# EAGLE schematic LED_panel_rev3.15 (EAGLE 9.0.1)

## Sheet 1 of 8: Supply
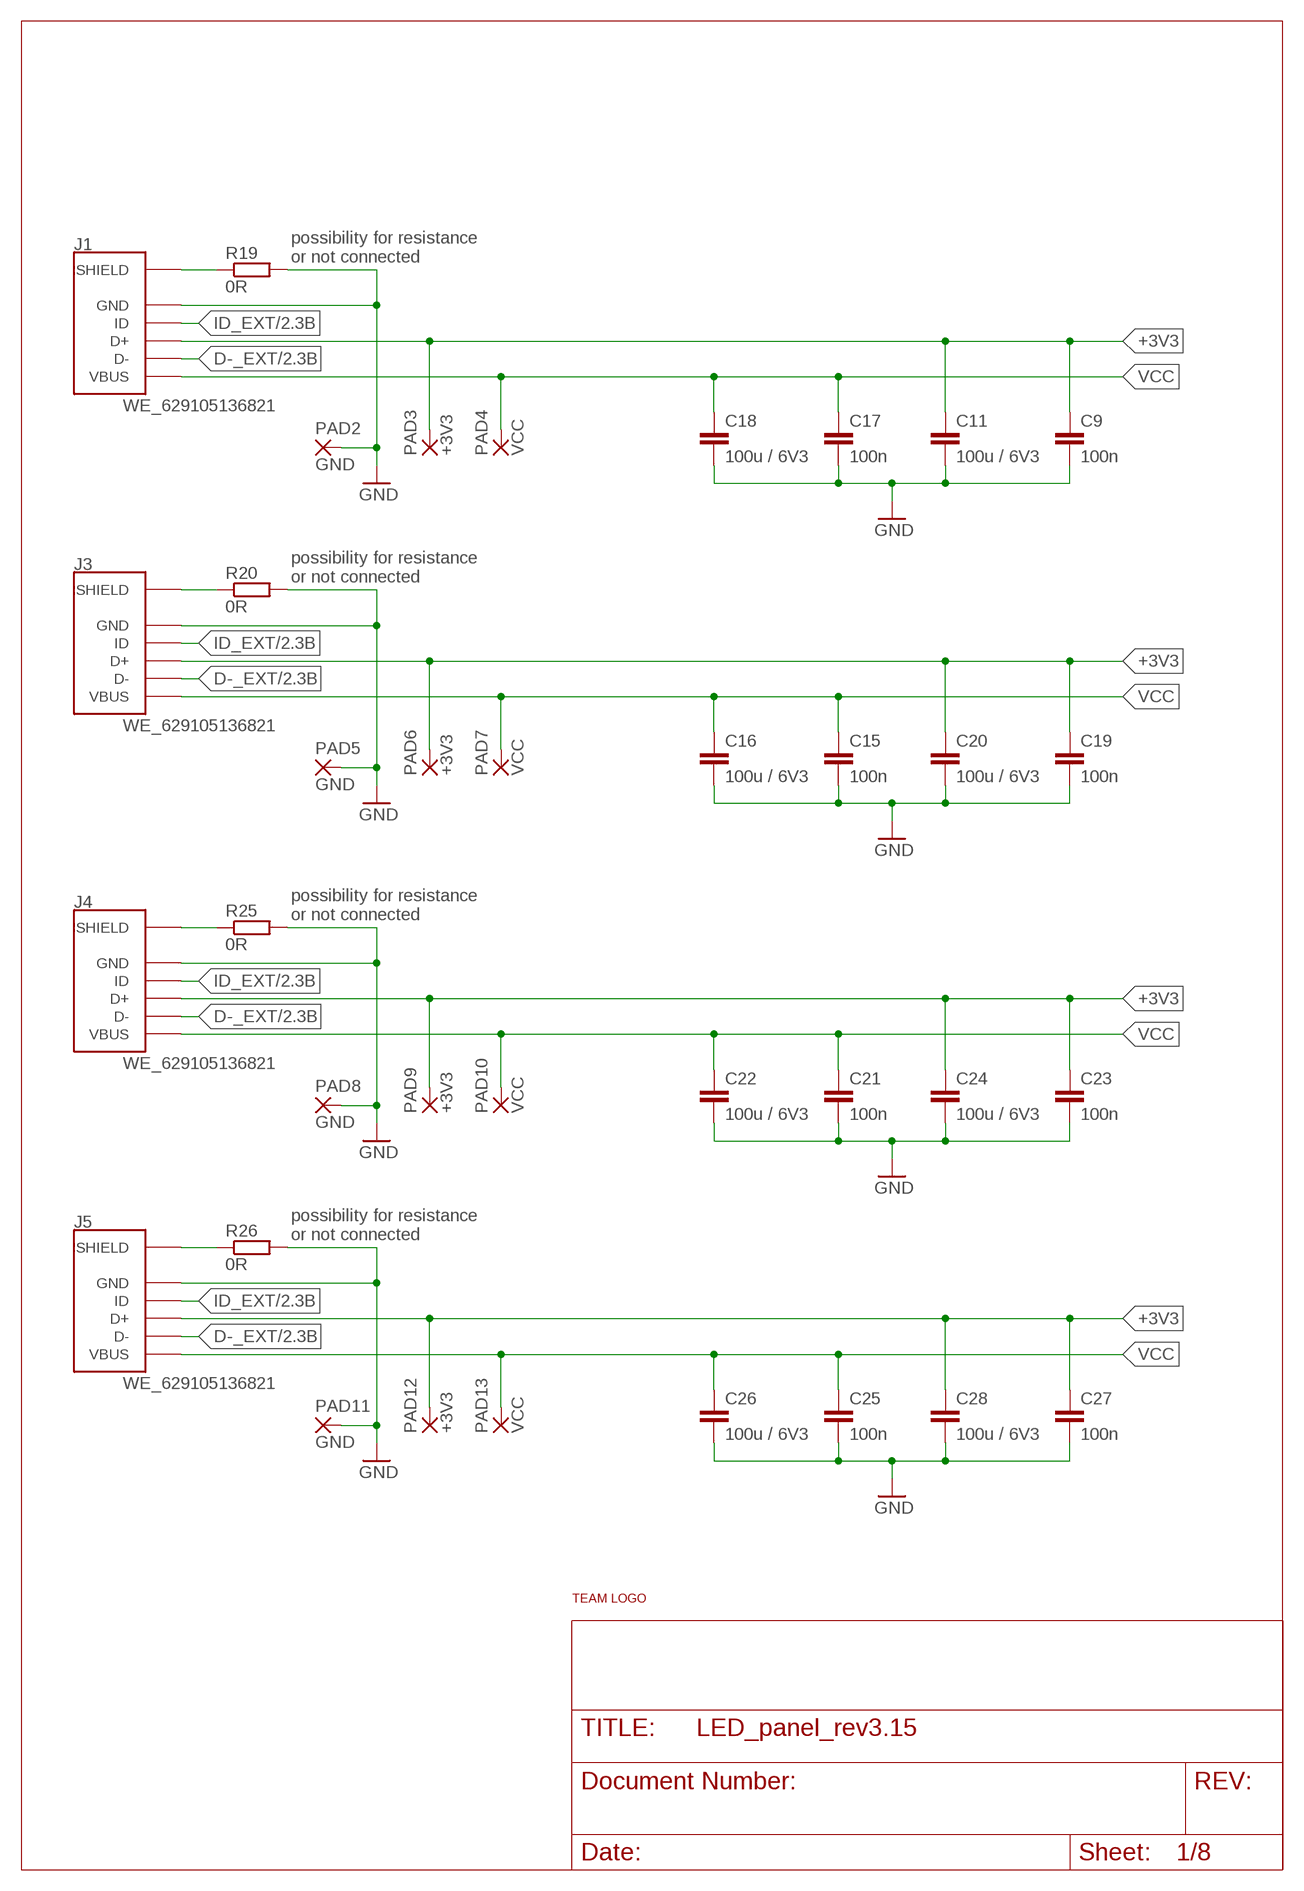
[diagram p0: schematic, sheet 1]

### Parts
C9  100n  C-EUC1206K  [C1206K]
C11  100u / 6V3  C-EUC1206K  [C1206K]
C15  100n  C-EUC1206K  [C1206K]
C16  100u / 6V3  C-EUC1206K  [C1206K]
C17  100n  C-EUC1206K  [C1206K]
C18  100u / 6V3  C-EUC1206K  [C1206K]
C19  100n  C-EUC1206K  [C1206K]
C20  100u / 6V3  C-EUC1206K  [C1206K]
C21  100n  C-EUC1206K  [C1206K]
C22  100u / 6V3  C-EUC1206K  [C1206K]
C23  100n  C-EUC1206K  [C1206K]
C24  100u / 6V3  C-EUC1206K  [C1206K]
C25  100n  C-EUC1206K  [C1206K]
C26  100u / 6V3  C-EUC1206K  [C1206K]
C27  100n  C-EUC1206K  [C1206K]
C28  100u / 6V3  C-EUC1206K  [C1206K]
J1  WE_629105136821  [629105136821]
J3  WE_629105136821  [629105136821]
J4  WE_629105136821  [629105136821]
J5  WE_629105136821  [629105136821]
PAD2  GND  2,54/1,0  [2,54/1,0]
PAD3  +3V3  2,54/1,0  [2,54/1,0]
PAD4  VCC  2,54/1,0  [2,54/1,0]
PAD5  GND  2,54/1,0  [2,54/1,0]
PAD6  +3V3  2,54/1,0  [2,54/1,0]
PAD7  VCC  2,54/1,0  [2,54/1,0]
PAD8  GND  2,54/1,0  [2,54/1,0]
PAD9  +3V3  2,54/1,0  [2,54/1,0]
PAD10  VCC  2,54/1,0  [2,54/1,0]
PAD11  GND  2,54/1,0  [2,54/1,0]
PAD12  +3V3  2,54/1,0  [2,54/1,0]
PAD13  VCC  2,54/1,0  [2,54/1,0]
R19  0R  R-EU_R1206  [R1206]
R20  0R  R-EU_R1206  [R1206]
R25  0R  R-EU_R1206  [R1206]
R26  0R  R-EU_R1206  [R1206]
U$99  LOGO_RESTRICT  [LOGO_RESTRICT]

### Nets
+3V3 [supply]: C9.1 C11.1 C19.1 C20.1 C23.1 C24.1 C27.1 C28.1 J1.3(D+) J3.3(D+) J4.3(D+) J5.3(D+) PAD3.1(P) PAD6.1(P) PAD9.1(P) PAD12.1(P) ; also sheet 2,3,4,5,6
D-_EXT: J1.2(D-) J3.2(D-) J4.2(D-) J5.2(D-) ; also sheet 2
GND [supply]: C9.2 C11.2 C15.2 C16.2 C17.2 C18.2 C19.2 C20.2 C21.2 C22.2 C23.2 C24.2 C25.2 C26.2 C27.2 C28.2 J1.5(GND) J3.5(GND) J4.5(GND) J5.5(GND) PAD2.1(P) PAD5.1(P) PAD8.1(P) PAD11.1(P) R19.2 R20.2 R25.2 R26.2 ; also sheet 2,3,4,5,6,7
ID_EXT: J1.4(ID) J3.4(ID) J4.4(ID) J5.4(ID) ; also sheet 2,3
SHIELD1: J1.6(SHIELD) J1.7(SHIELD) J1.8(SHIELD) J1.9(SHIELD) R19.1
SHIELD3: J3.6(SHIELD) J3.7(SHIELD) J3.8(SHIELD) J3.9(SHIELD) R20.1
SHIELD4: J4.6(SHIELD) J4.7(SHIELD) J4.8(SHIELD) J4.9(SHIELD) R25.1
SHIELD5: J5.6(SHIELD) J5.7(SHIELD) J5.8(SHIELD) J5.9(SHIELD) R26.1
VCC [supply]: C15.1 C16.1 C17.1 C18.1 C21.1 C22.1 C25.1 C26.1 J1.1(VBUS) J3.1(VBUS) J4.1(VBUS) J5.1(VBUS) PAD4.1(P) PAD7.1(P) PAD10.1(P) PAD13.1(P) ; also sheet 3,5,6

### Notes on the sheet
- possibility for resistance
  or not connected
- possibility for resistance
  or not connected
- possibility for resistance
  or not connected
- possibility for resistance
  or not connected

## Sheet 2 of 8: teensy 3.2
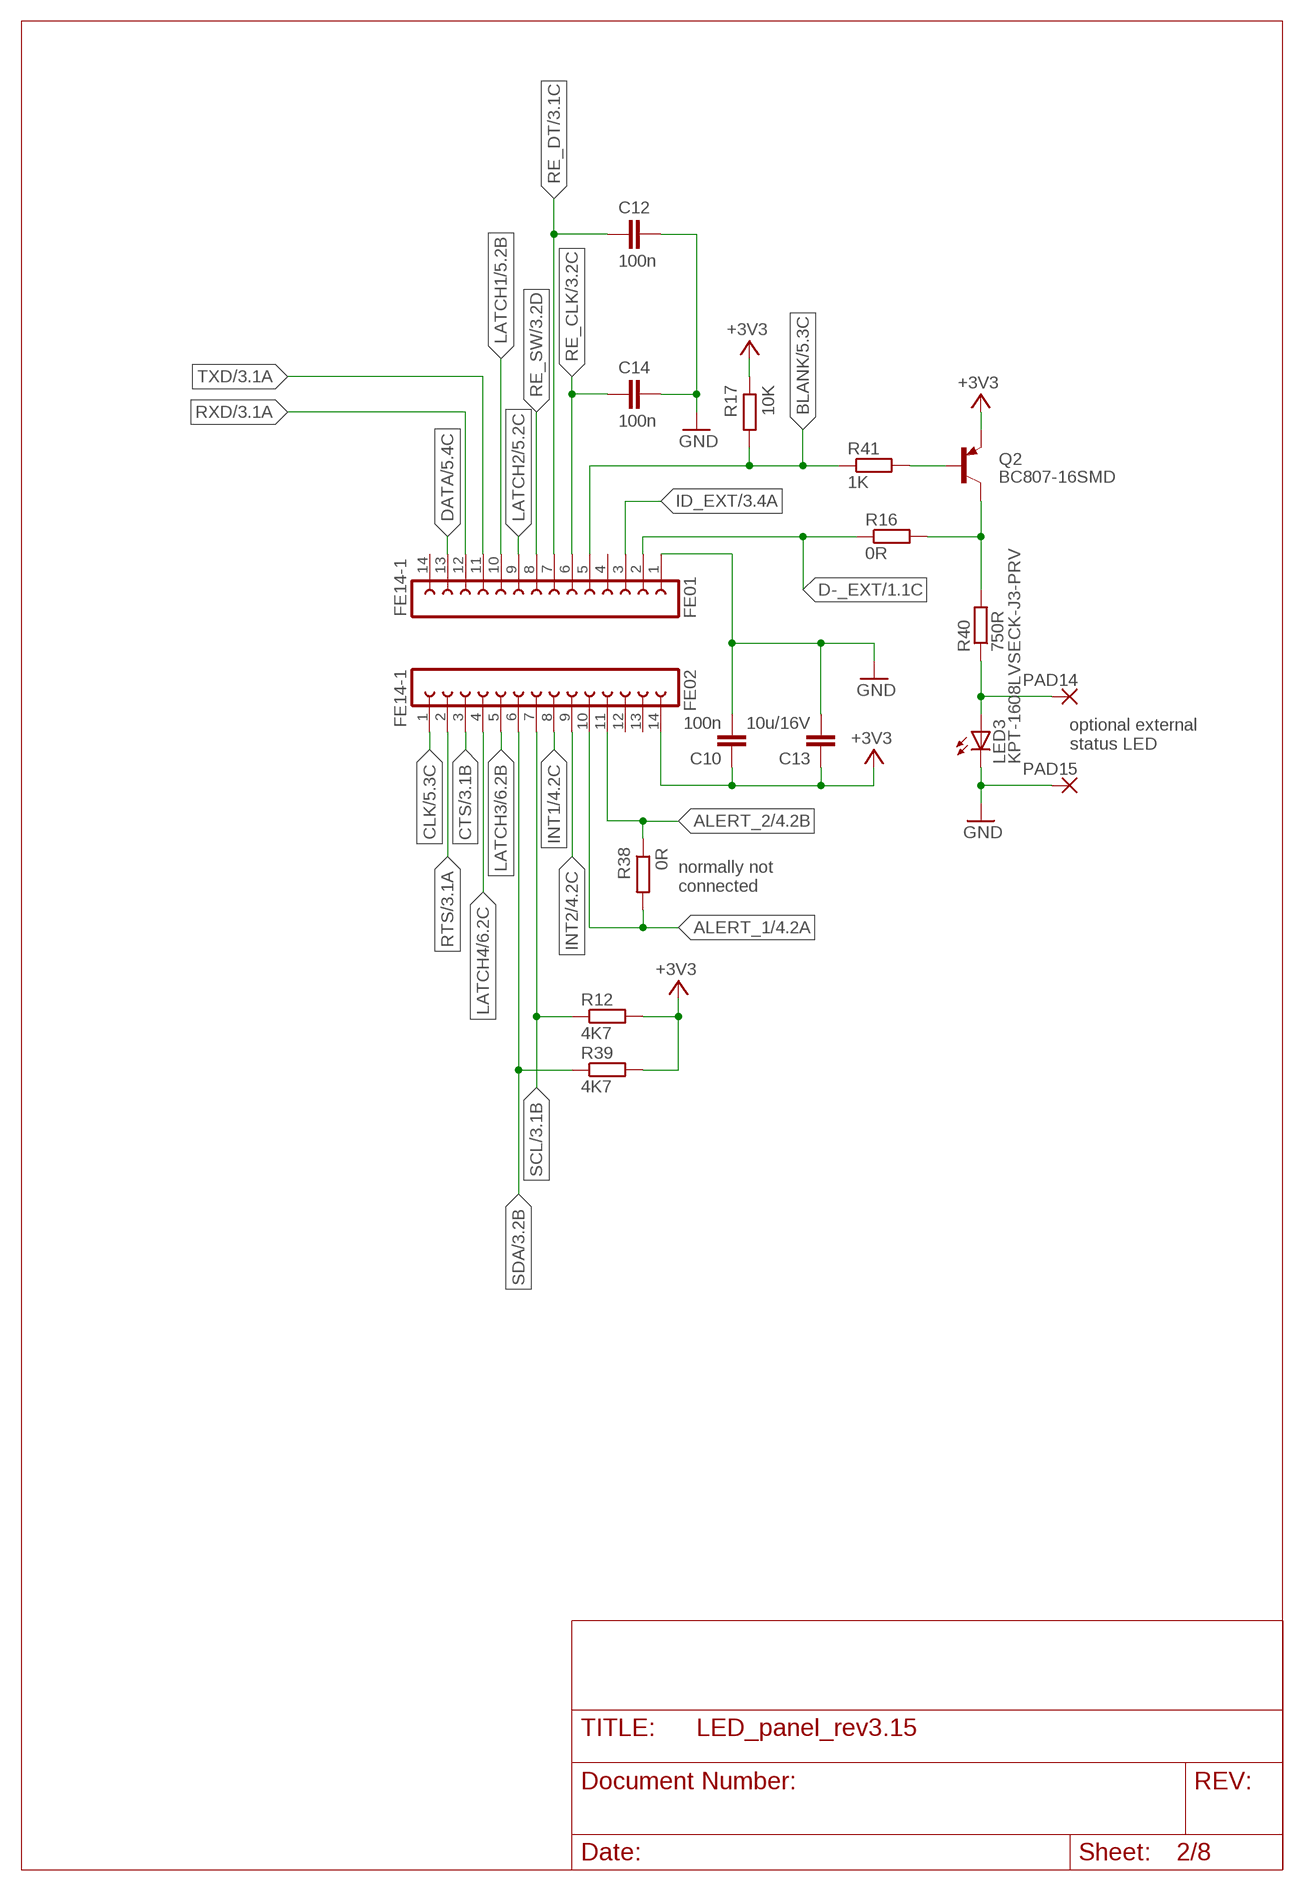
[diagram p1: schematic, sheet 2]

### Parts
C10  100n  C-EUC1206K  [C1206K]
C12  100n  C-EUC1206K  [C1206K]
C13  10u/16V  C-EUC1206K  [C1206K]
C14  100n  C-EUC1206K  [C1206K]
FE01  FE14-1  [FE14]
FE02  FE14-1  [FE14]
LED3  KPT-1608LVSECK-J3-PRV  [MH_KINGBRIGHT_1.6X0.8]
PAD14  2,54/1,0  [2,54/1,0]
PAD15  2,54/1,0  [2,54/1,0]
Q2  BC807-16SMD  [SOT23-BEC]
R12  4K7  R-EU_R1206  [R1206]
R16  0R  R-EU_R1206  [R1206]
R17  10K  R-EU_R1206  [R1206]
R38  0R  R-EU_R1206  [R1206]
R39  4K7  R-EU_R1206  [R1206]
R40  750R  R-EU_R1206  [R1206]
R41  1K  R-EU_R1206  [R1206]

### Nets
+3V3 [supply]: C10.1 C13.1 FE02.14 Q2.E R12.2 R17.1 R39.2 ; also sheet 1,3,4,5,6
ALERT_1: FE02.10 R38.2 ; also sheet 4
ALERT_2: FE02.11 R38.1 ; also sheet 4
BLANK: FE01.5 R17.2 R41.1 ; also sheet 5,6
CLK: FE02.1 ; also sheet 5,6
CTS: FE02.3 ; also sheet 3
D-_EXT: FE01.2 R16.1 ; also sheet 1
DATA: FE01.13 ; also sheet 5,6
GND [supply]: C10.2 C12.1 C13.2 C14.1 FE01.1 LED3.C PAD15.1(P) ; also sheet 1,3,4,5,6,7
ID_EXT: FE01.3 ; also sheet 1,3
INT1: FE02.8 ; also sheet 4
INT2: FE02.9 ; also sheet 4
LATCH1: FE01.10 ; also sheet 5
LATCH2: FE01.9 ; also sheet 5
LATCH3: FE02.5 ; also sheet 6
LATCH4: FE02.4 ; also sheet 6
N$84: Q2.B R41.2
N$109: Q2.C R16.2 R40.2
N$113: LED3.A PAD14.1(P) R40.1
RE_CLK: C14.2 FE01.6 ; also sheet 3
RE_DT: C12.2 FE01.7 ; also sheet 3
RE_SW: FE01.8 ; also sheet 3
RTS: FE02.2 ; also sheet 3
RXD: FE01.12 ; also sheet 3
SCL: FE02.7 R12.1 ; also sheet 3,4
SDA: FE02.6 R39.1 ; also sheet 3,4
TXD: FE01.11 ; also sheet 3
Unconnected: FE01.4 FE01.14 FE02.12 FE02.13

### Notes on the sheet
- optional external
  status LED
- normally not
  connected

## Sheet 3 of 8: connectivity
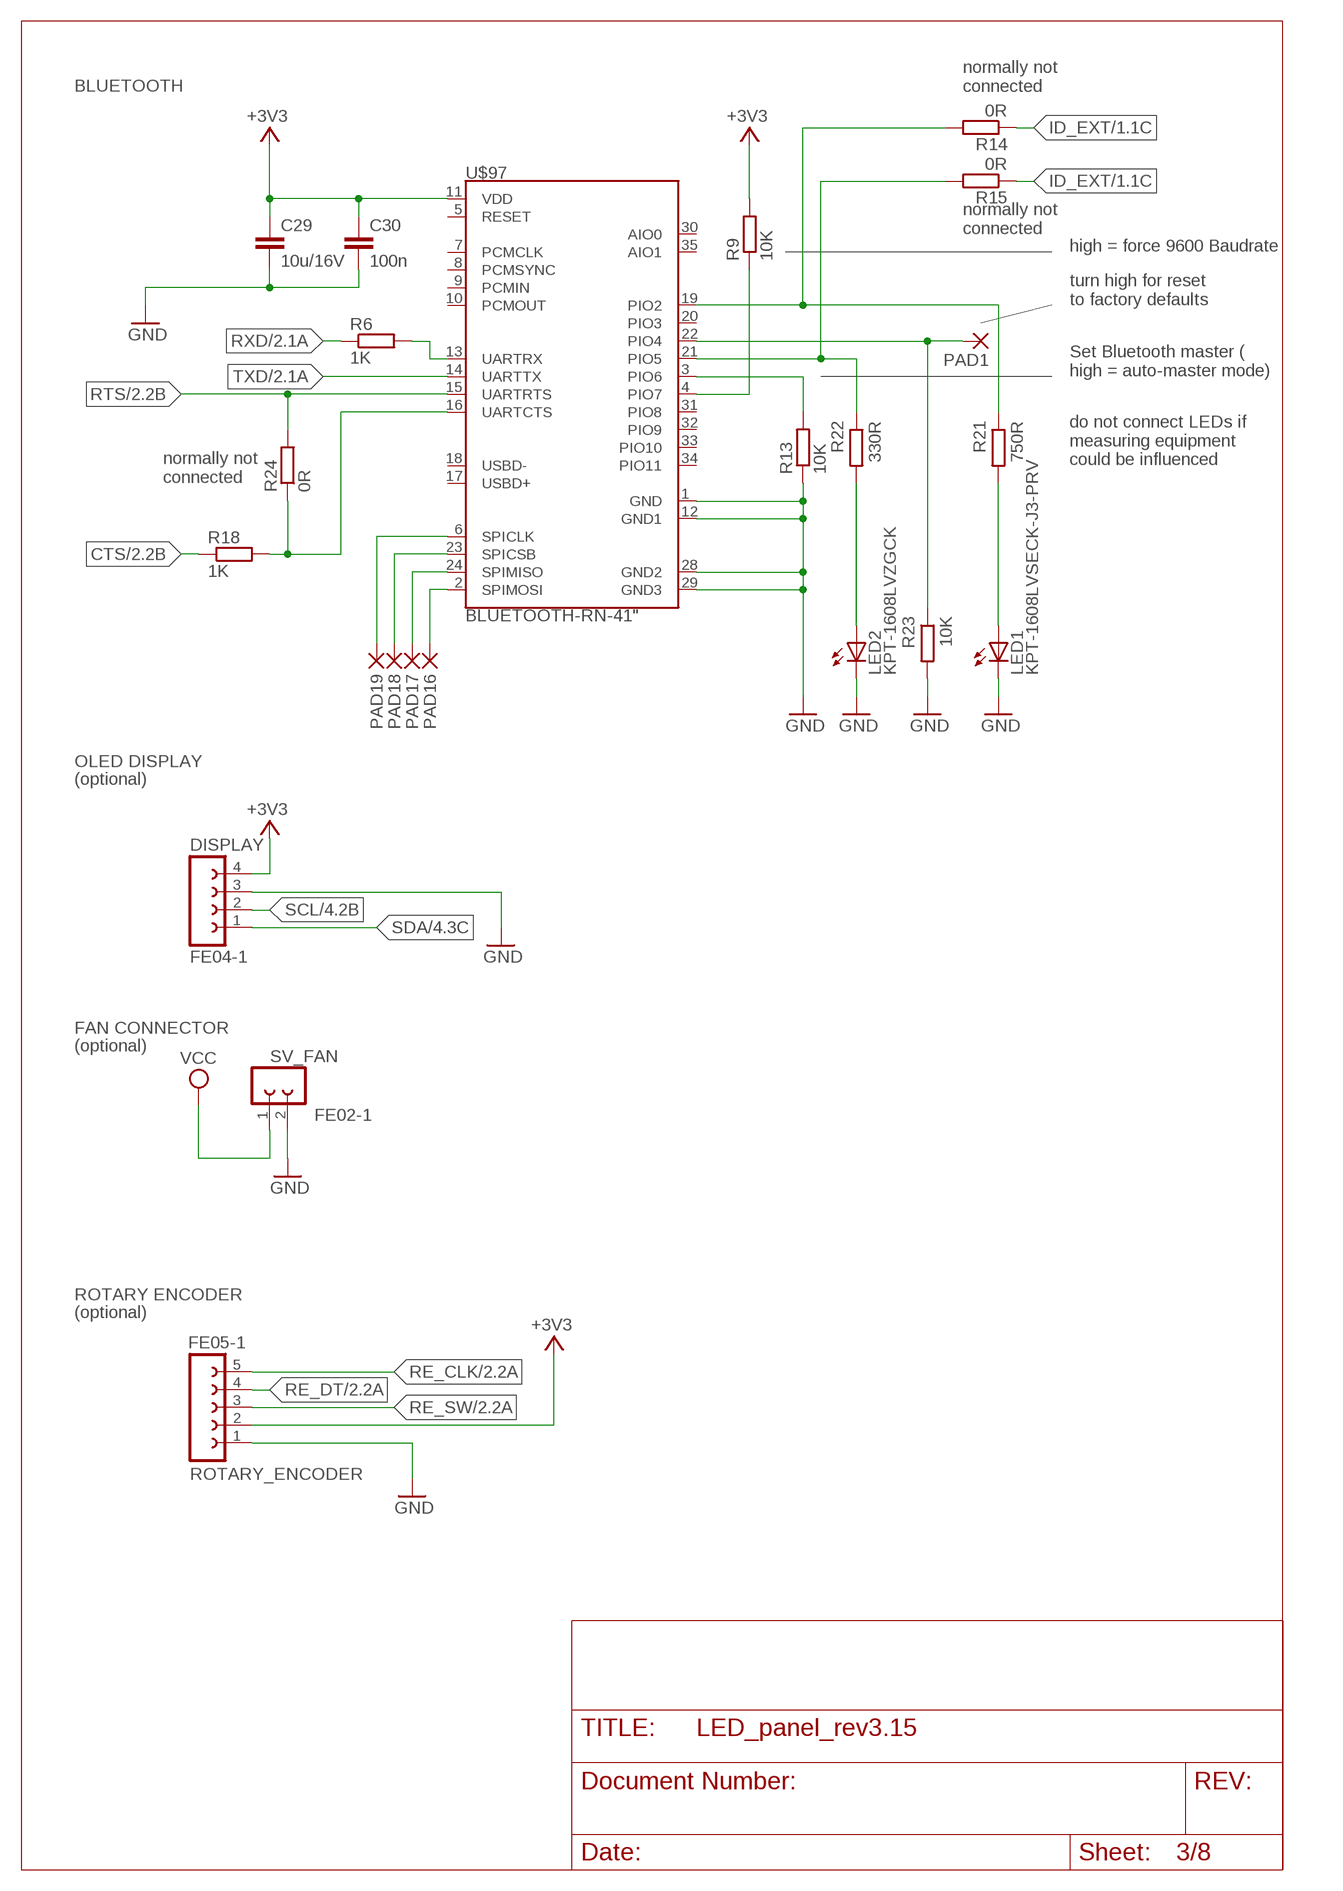
[diagram p2: schematic, sheet 3]

### Parts
C29  10u/16V  C-EUC1206K  [C1206K]
C30  100n  C-EUC1206K  [C1206K]
DISPLAY  FE04-1  [FE04]
LED1  KPT-1608LVSECK-J3-PRV  [MH_KINGBRIGHT_1.6X0.8]
LED2  KPT-1608LVZGCK  [MH_KINGBRIGHT_1.6X0.8]
PAD1  2,54/1,0  [2,54/1,0]
PAD16  2,54/1,0  [2,54/1,0]
PAD17  2,54/1,0  [2,54/1,0]
PAD18  2,54/1,0  [2,54/1,0]
PAD19  2,54/1,0  [2,54/1,0]
R6  1K  R-EU_R1206  [R1206]
R9  10K  R-EU_R1206  [R1206]
R13  10K  R-EU_R1206  [R1206]
R14  0R  R-EU_R1206  [R1206]
R15  0R  R-EU_R1206  [R1206]
R18  1K  R-EU_R1206  [R1206]
R21  750R  R-EU_R1206  [R1206]
R22  330R  R-EU_R1206  [R1206]
R23  10K  R-EU_R1206  [R1206]
R24  0R  R-EU_R1206  [R1206]
ROTARY_ENCODER  FE05-1  [FE05]
SV_FAN  FE02-1  [FE02]
U$97  BLUETOOTH-RN-41"  [RN41]

### Nets
+3V3 [supply]: C29.1 C30.1 DISPLAY.4 R9.2 ROTARY_ENCODER.2 U$97.11(VDD) ; also sheet 1,2,4,5,6
CTS: R18.1 ; also sheet 2
GND [supply]: C29.2 C30.2 DISPLAY.3 LED1.C LED2.C R13.1 R23.2 ROTARY_ENCODER.1 SV_FAN.2 U$97.1(GND) U$97.12(GND1) U$97.28(GND2) U$97.29(GND3) ; also sheet 1,2,4,5,6,7
ID_EXT: R14.1 R15.1 ; also sheet 1,2
N$1: R9.1 U$97.4(PIO7)
N$22: R13.2 U$97.3(PIO6)
N$23: R18.2 R24.1 U$97.16(UARTCTS)
N$56: PAD16.1(P) U$97.2(SPIMOSI)
N$83: PAD17.1(P) U$97.24(SPIMISO)
N$110: R6.2 U$97.13(UARTRX)
N$112: PAD18.1(P) U$97.23(SPICSB)
N$115: R15.2 R22.1 U$97.21(PIO5)
N$116: LED2.A R22.2
N$117: PAD19.1(P) U$97.6(SPICLK)
N$118: LED1.A R21.2
N$120: R14.2 R21.1 U$97.19(PIO2)
PIO4: PAD1.1(P) R23.1 U$97.22(PIO4)
RE_CLK: ROTARY_ENCODER.5 ; also sheet 2
RE_DT: ROTARY_ENCODER.4 ; also sheet 2
RE_SW: ROTARY_ENCODER.3 ; also sheet 2
RTS: R24.2 U$97.15(UARTRTS) ; also sheet 2
RXD: R6.1 ; also sheet 2
SCL: DISPLAY.2 ; also sheet 2,4
SDA: DISPLAY.1 ; also sheet 2,4
TXD: U$97.14(UARTTX) ; also sheet 2
VCC [supply]: SV_FAN.1 ; also sheet 1,5,6
Unconnected: U$97.5(RESET) U$97.7(PCMCLK) U$97.8(PCMSYNC) U$97.9(PCMIN) U$97.10(PCMOUT) U$97.17(USBD+) U$97.18(USBD-) U$97.20(PIO3) U$97.30(AIO0) U$97.31(PIO8) U$97.32(PIO9) U$97.33(PIO10) U$97.34(PIO11) U$97.35(AIO1)

### Notes on the sheet
- BLUETOOTH
- normally not
  connected
- normally not
  connected
- high = force 9600 Baudrate
- turn high for reset
  to factory defaults
- Set Bluetooth master (
  high = auto-master mode)
- do not connect LEDs if 
  measuring equipment 
  could be influenced
- normally not
  connected
- OLED DISPLAY
- (optional)
- FAN CONNECTOR
- (optional)
- ROTARY ENCODER
- (optional)

## Sheet 4 of 8: sensors
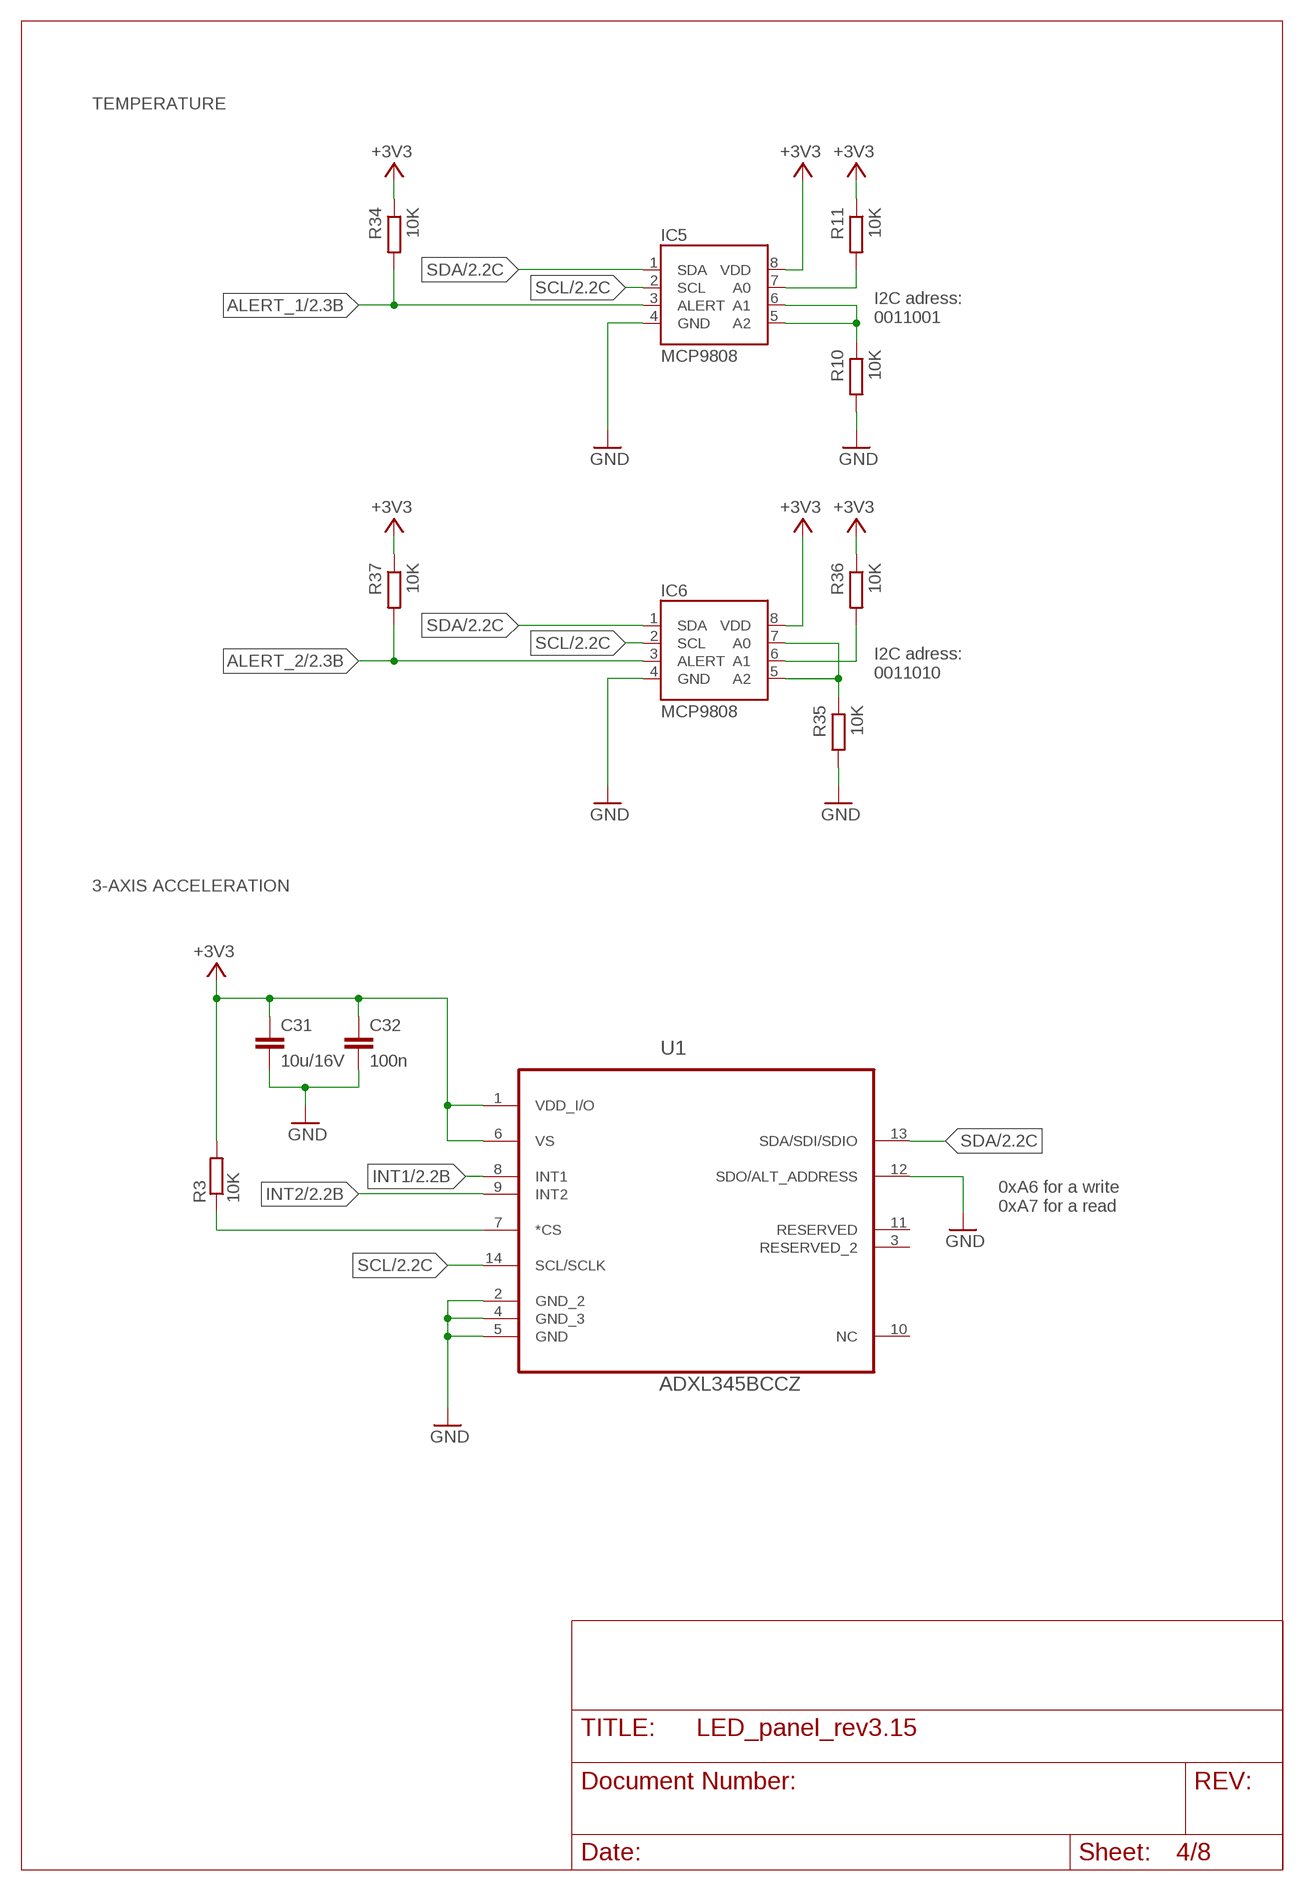
[diagram p3: schematic, sheet 4]

### Parts
C31  10u/16V  C-EUC1206K  [C1206K]
C32  100n  C-EUC1206K  [C1206K]
IC5  MCP9808  [MSOP8]
IC6  MCP9808  [MSOP8]
R3  10K  R-EU_R1206  [R1206]
R10  10K  R-EU_R1206  [R1206]
R11  10K  R-EU_R1206  [R1206]
R34  10K  R-EU_R1206  [R1206]
R35  10K  R-EU_R1206  [R1206]
R36  10K  R-EU_R1206  [R1206]
R37  10K  R-EU_R1206  [R1206]
U1  ADXL345BCCZ  [LGA14R80P3X6_300X500X100]

### Nets
+3V3 [supply]: C31.1 C32.1 IC5.8(VDD) IC6.8(VDD) R3.2 R11.1 R34.1 R36.1 R37.1 U1.1(VDD_I/O) U1.6(VS) ; also sheet 1,2,3,5,6
ALERT_1: IC5.3(ALERT) R34.2 ; also sheet 2
ALERT_2: IC6.3(ALERT) R37.2 ; also sheet 2
GND [supply]: C31.2 C32.2 IC5.4(GND) IC6.4(GND) R10.2 R35.2 U1.2(GND_2) U1.4(GND_3) U1.5(GND) U1.12(SDO/ALT_ADDRESS) ; also sheet 1,2,3,5,6,7
INT1: U1.8(INT1) ; also sheet 2
INT2: U1.9(INT2) ; also sheet 2
N$55: IC5.5(A2) IC5.6(A1) R10.1
N$57: IC5.7(A0) R11.2
N$82: IC6.5(A2) IC6.7(A0) R35.1
N$111: R3.1 U1.7(*CS)
N$137: IC6.6(A1) R36.2
SCL: IC5.2(SCL) IC6.2(SCL) U1.14(SCL/SCLK) ; also sheet 2,3
SDA: IC5.1(SDA) IC6.1(SDA) U1.13(SDA/SDI/SDIO) ; also sheet 2,3
Unconnected: U1.3(RESERVED_2) U1.10(NC) U1.11(RESERVED)

### Notes on the sheet
- TEMPERATURE
- I2C adress:
  0011001
- I2C adress:
  0011010
- 3-AXIS ACCELERATION
- 0xA6 for a write
  0xA7 for a read

## Sheet 5 of 8: TLC5947 1&2
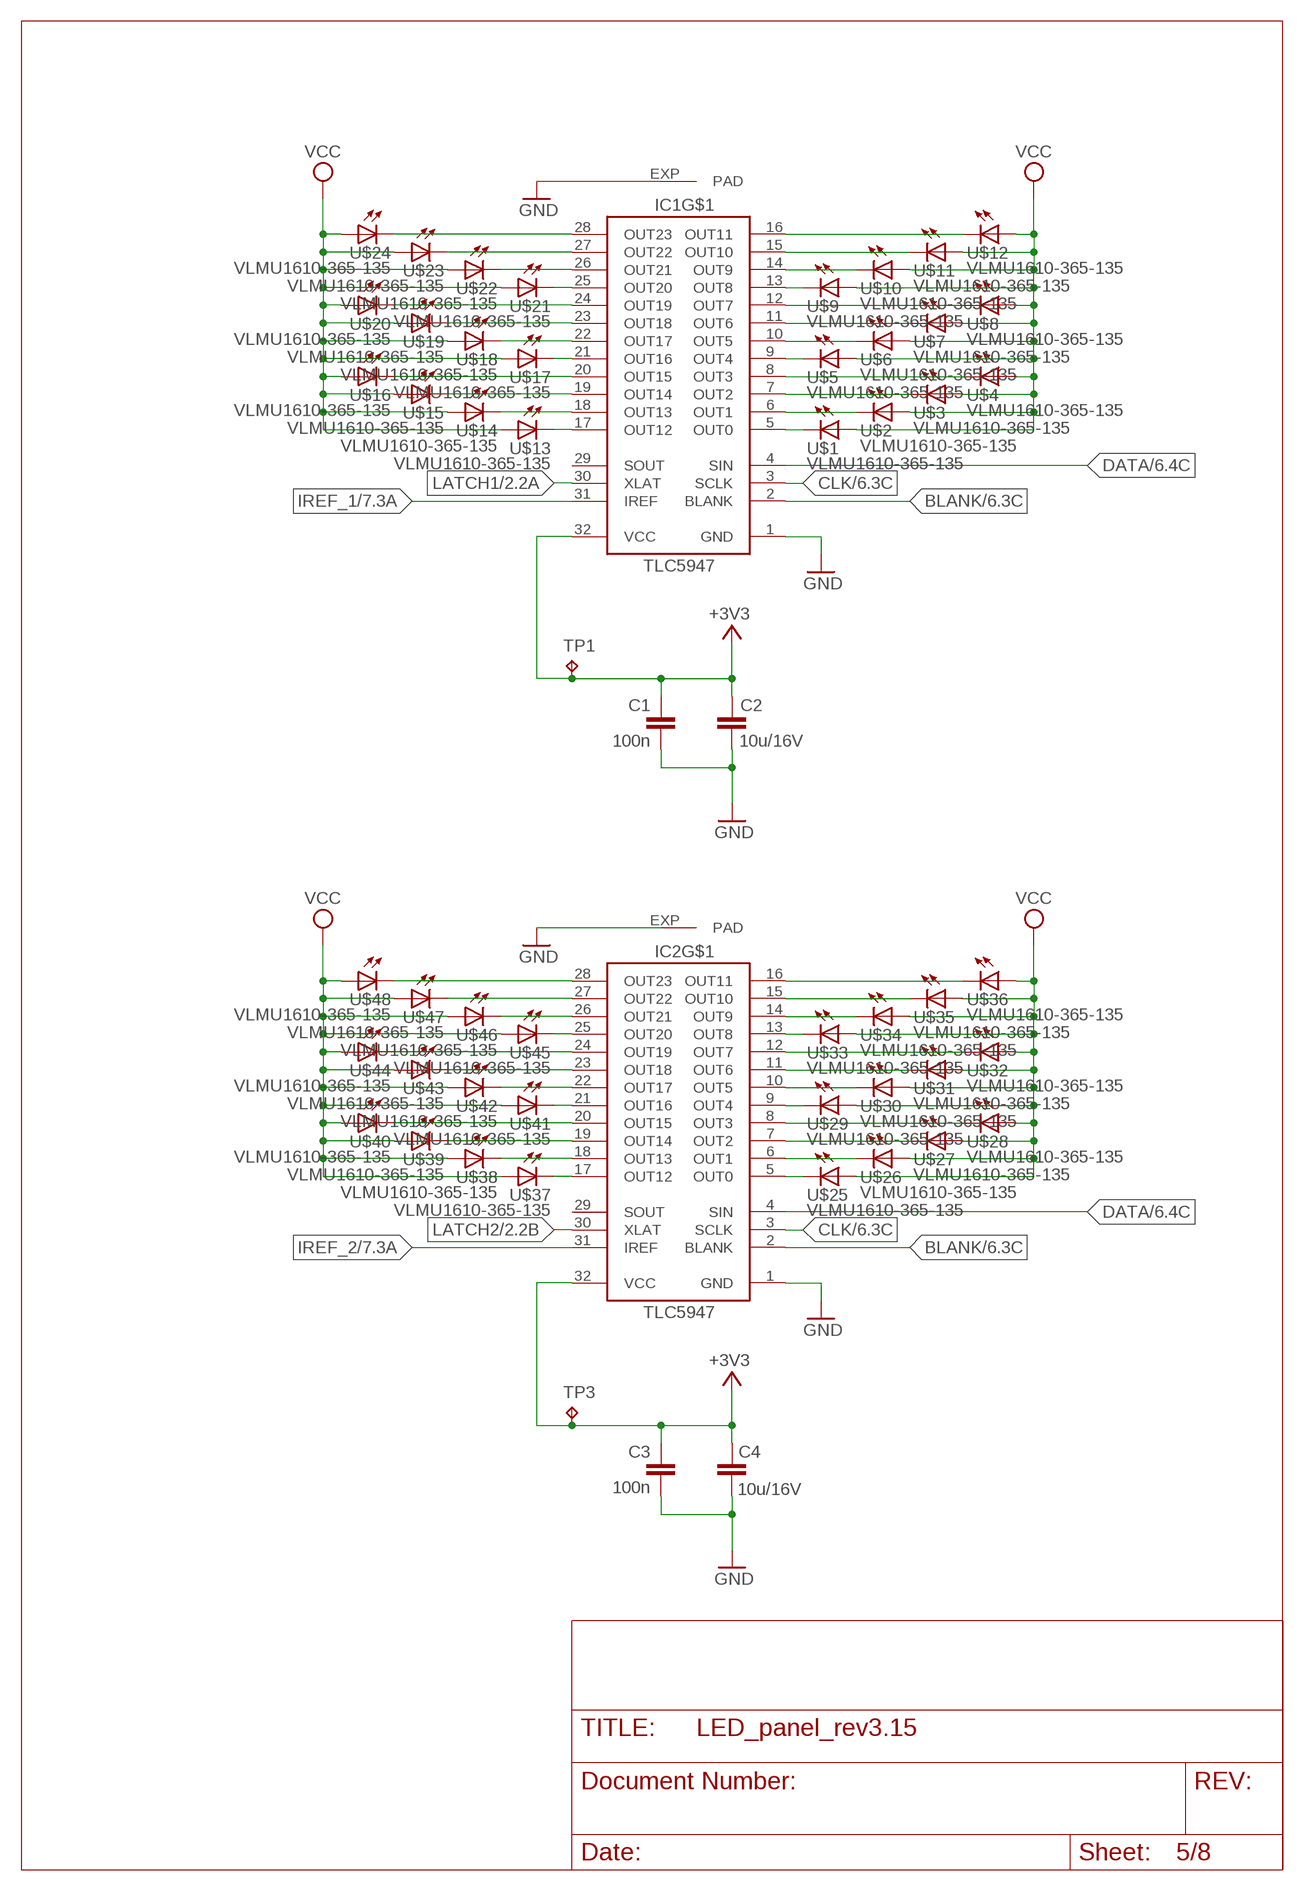
[diagram p4: schematic, sheet 5]

### Parts
C1  100n  C-EUC1206K  [C1206K]
C2  10u/16V  C-EUC1206K  [C1206K]
C3  100n  C-EUC1206K  [C1206K]
C4  10u/16V  C-EUC1206K  [C1206K]
IC1  TLC5947-DAP  [HTSSOP32DAP]
IC2  TLC5947-DAP  [HTSSOP32DAP]
TP1  TPTP20R  [TP20R]
TP3  TPTP20R  [TP20R]
U$1  VLMU1610-365-135  [SMD_CERAMIC_MID_POWER]
U$2  VLMU1610-365-135  [SMD_CERAMIC_MID_POWER]
U$3  VLMU1610-365-135  [SMD_CERAMIC_MID_POWER]
U$4  VLMU1610-365-135  [SMD_CERAMIC_MID_POWER]
U$5  VLMU1610-365-135  [SMD_CERAMIC_MID_POWER]
U$6  VLMU1610-365-135  [SMD_CERAMIC_MID_POWER]
U$7  VLMU1610-365-135  [SMD_CERAMIC_MID_POWER]
U$8  VLMU1610-365-135  [SMD_CERAMIC_MID_POWER]
U$9  VLMU1610-365-135  [SMD_CERAMIC_MID_POWER]
U$10  VLMU1610-365-135  [SMD_CERAMIC_MID_POWER]
U$11  VLMU1610-365-135  [SMD_CERAMIC_MID_POWER]
U$12  VLMU1610-365-135  [SMD_CERAMIC_MID_POWER]
U$13  VLMU1610-365-135  [SMD_CERAMIC_MID_POWER]
U$14  VLMU1610-365-135  [SMD_CERAMIC_MID_POWER]
U$15  VLMU1610-365-135  [SMD_CERAMIC_MID_POWER]
U$16  VLMU1610-365-135  [SMD_CERAMIC_MID_POWER]
U$17  VLMU1610-365-135  [SMD_CERAMIC_MID_POWER]
U$18  VLMU1610-365-135  [SMD_CERAMIC_MID_POWER]
U$19  VLMU1610-365-135  [SMD_CERAMIC_MID_POWER]
U$20  VLMU1610-365-135  [SMD_CERAMIC_MID_POWER]
U$21  VLMU1610-365-135  [SMD_CERAMIC_MID_POWER]
U$22  VLMU1610-365-135  [SMD_CERAMIC_MID_POWER]
U$23  VLMU1610-365-135  [SMD_CERAMIC_MID_POWER]
U$24  VLMU1610-365-135  [SMD_CERAMIC_MID_POWER]
U$25  VLMU1610-365-135  [SMD_CERAMIC_MID_POWER]
U$26  VLMU1610-365-135  [SMD_CERAMIC_MID_POWER]
U$27  VLMU1610-365-135  [SMD_CERAMIC_MID_POWER]
U$28  VLMU1610-365-135  [SMD_CERAMIC_MID_POWER]
U$29  VLMU1610-365-135  [SMD_CERAMIC_MID_POWER]
U$30  VLMU1610-365-135  [SMD_CERAMIC_MID_POWER]
U$31  VLMU1610-365-135  [SMD_CERAMIC_MID_POWER]
U$32  VLMU1610-365-135  [SMD_CERAMIC_MID_POWER]
U$33  VLMU1610-365-135  [SMD_CERAMIC_MID_POWER]
U$34  VLMU1610-365-135  [SMD_CERAMIC_MID_POWER]
U$35  VLMU1610-365-135  [SMD_CERAMIC_MID_POWER]
U$36  VLMU1610-365-135  [SMD_CERAMIC_MID_POWER]
U$37  VLMU1610-365-135  [SMD_CERAMIC_MID_POWER]
U$38  VLMU1610-365-135  [SMD_CERAMIC_MID_POWER]
U$39  VLMU1610-365-135  [SMD_CERAMIC_MID_POWER]
U$40  VLMU1610-365-135  [SMD_CERAMIC_MID_POWER]
U$41  VLMU1610-365-135  [SMD_CERAMIC_MID_POWER]
U$42  VLMU1610-365-135  [SMD_CERAMIC_MID_POWER]
U$43  VLMU1610-365-135  [SMD_CERAMIC_MID_POWER]
U$44  VLMU1610-365-135  [SMD_CERAMIC_MID_POWER]
U$45  VLMU1610-365-135  [SMD_CERAMIC_MID_POWER]
U$46  VLMU1610-365-135  [SMD_CERAMIC_MID_POWER]
U$47  VLMU1610-365-135  [SMD_CERAMIC_MID_POWER]
U$48  VLMU1610-365-135  [SMD_CERAMIC_MID_POWER]

### Nets
+3V3 [supply]: C1.2 C2.2 C3.2 C4.2 IC1.32(VCC) IC2.32(VCC) TP1.TP TP3.TP ; also sheet 1,2,3,4,6
BLANK: IC1.2(BLANK) IC2.2(BLANK) ; also sheet 2,6
CLK: IC1.3(SCLK) IC2.3(SCLK) ; also sheet 2,6
DATA: IC1.4(SIN) IC2.4(SIN) ; also sheet 2,6
GND [supply]: C1.1 C2.1 C3.1 C4.1 IC1.1(GND) IC1.EXP(PAD) IC2.1(GND) IC2.EXP(PAD) ; also sheet 1,2,3,4,6,7
IREF_1: IC1.31(IREF) ; also sheet 7
IREF_2: IC2.31(IREF) ; also sheet 7
LATCH1: IC1.30(XLAT) ; also sheet 2
LATCH2: IC2.30(XLAT) ; also sheet 2
N$4: IC1.28(OUT23) U$24.P$2(C)
N$5: IC1.27(OUT22) U$23.P$2(C)
N$6: IC1.26(OUT21) U$22.P$2(C)
N$7: IC1.25(OUT20) U$21.P$2(C)
N$8: IC1.24(OUT19) U$20.P$2(C)
N$9: IC1.23(OUT18) U$19.P$2(C)
N$10: IC1.22(OUT17) U$18.P$2(C)
N$11: IC1.21(OUT16) U$17.P$2(C)
N$12: IC1.20(OUT15) U$16.P$2(C)
N$13: IC1.19(OUT14) U$15.P$2(C)
N$14: IC1.18(OUT13) U$14.P$2(C)
N$15: IC1.17(OUT12) U$13.P$2(C)
N$16: IC1.16(OUT11) U$12.P$2(C)
N$17: IC1.15(OUT10) U$11.P$2(C)
N$18: IC1.14(OUT9) U$10.P$2(C)
N$19: IC1.13(OUT8) U$9.P$2(C)
N$20: IC1.12(OUT7) U$8.P$2(C)
N$24: IC2.28(OUT23) U$48.P$2(C)
N$25: IC2.27(OUT22) U$47.P$2(C)
N$26: IC1.11(OUT6) U$7.P$2(C)
N$27: IC2.26(OUT21) U$46.P$2(C)
N$28: IC1.10(OUT5) U$6.P$2(C)
N$29: IC2.25(OUT20) U$45.P$2(C)
N$30: IC1.9(OUT4) U$5.P$2(C)
N$31: IC2.24(OUT19) U$44.P$2(C)
N$32: IC1.8(OUT3) U$4.P$2(C)
N$33: IC2.23(OUT18) U$43.P$2(C)
N$34: IC1.7(OUT2) U$3.P$2(C)
N$35: IC2.22(OUT17) U$42.P$2(C)
N$36: IC1.6(OUT1) U$2.P$2(C)
N$37: IC2.21(OUT16) U$41.P$2(C)
N$38: IC1.5(OUT0) U$1.P$2(C)
N$39: IC2.20(OUT15) U$40.P$2(C)
N$40: IC2.19(OUT14) U$39.P$2(C)
N$41: IC2.18(OUT13) U$38.P$2(C)
N$42: IC2.17(OUT12) U$37.P$2(C)
N$43: IC2.16(OUT11) U$36.P$2(C)
N$44: IC2.15(OUT10) U$35.P$2(C)
N$45: IC2.14(OUT9) U$34.P$2(C)
N$46: IC2.13(OUT8) U$33.P$2(C)
N$47: IC2.12(OUT7) U$32.P$2(C)
N$48: IC2.11(OUT6) U$31.P$2(C)
N$49: IC2.10(OUT5) U$30.P$2(C)
N$50: IC2.9(OUT4) U$29.P$2(C)
N$51: IC2.8(OUT3) U$28.P$2(C)
N$52: IC2.7(OUT2) U$27.P$2(C)
N$53: IC2.6(OUT1) U$26.P$2(C)
N$54: IC2.5(OUT0) U$25.P$2(C)
VCC [supply]: U$1.P$1(A) U$2.P$1(A) U$3.P$1(A) U$4.P$1(A) U$5.P$1(A) U$6.P$1(A) U$7.P$1(A) U$8.P$1(A) U$9.P$1(A) U$10.P$1(A) U$11.P$1(A) U$12.P$1(A) U$13.P$1(A) U$14.P$1(A) U$15.P$1(A) U$16.P$1(A) U$17.P$1(A) U$18.P$1(A) U$19.P$1(A) U$20.P$1(A) U$21.P$1(A) U$22.P$1(A) U$23.P$1(A) U$24.P$1(A) U$25.P$1(A) U$26.P$1(A) U$27.P$1(A) U$28.P$1(A) U$29.P$1(A) U$30.P$1(A) U$31.P$1(A) U$32.P$1(A) U$33.P$1(A) U$34.P$1(A) U$35.P$1(A) U$36.P$1(A) U$37.P$1(A) U$38.P$1(A) U$39.P$1(A) U$40.P$1(A) U$41.P$1(A) U$42.P$1(A) U$43.P$1(A) U$44.P$1(A) U$45.P$1(A) U$46.P$1(A) U$47.P$1(A) U$48.P$1(A) ; also sheet 1,3,6
Unconnected: IC1.29(SOUT) IC2.29(SOUT)

## Sheet 6 of 8: TLC5947 3&4
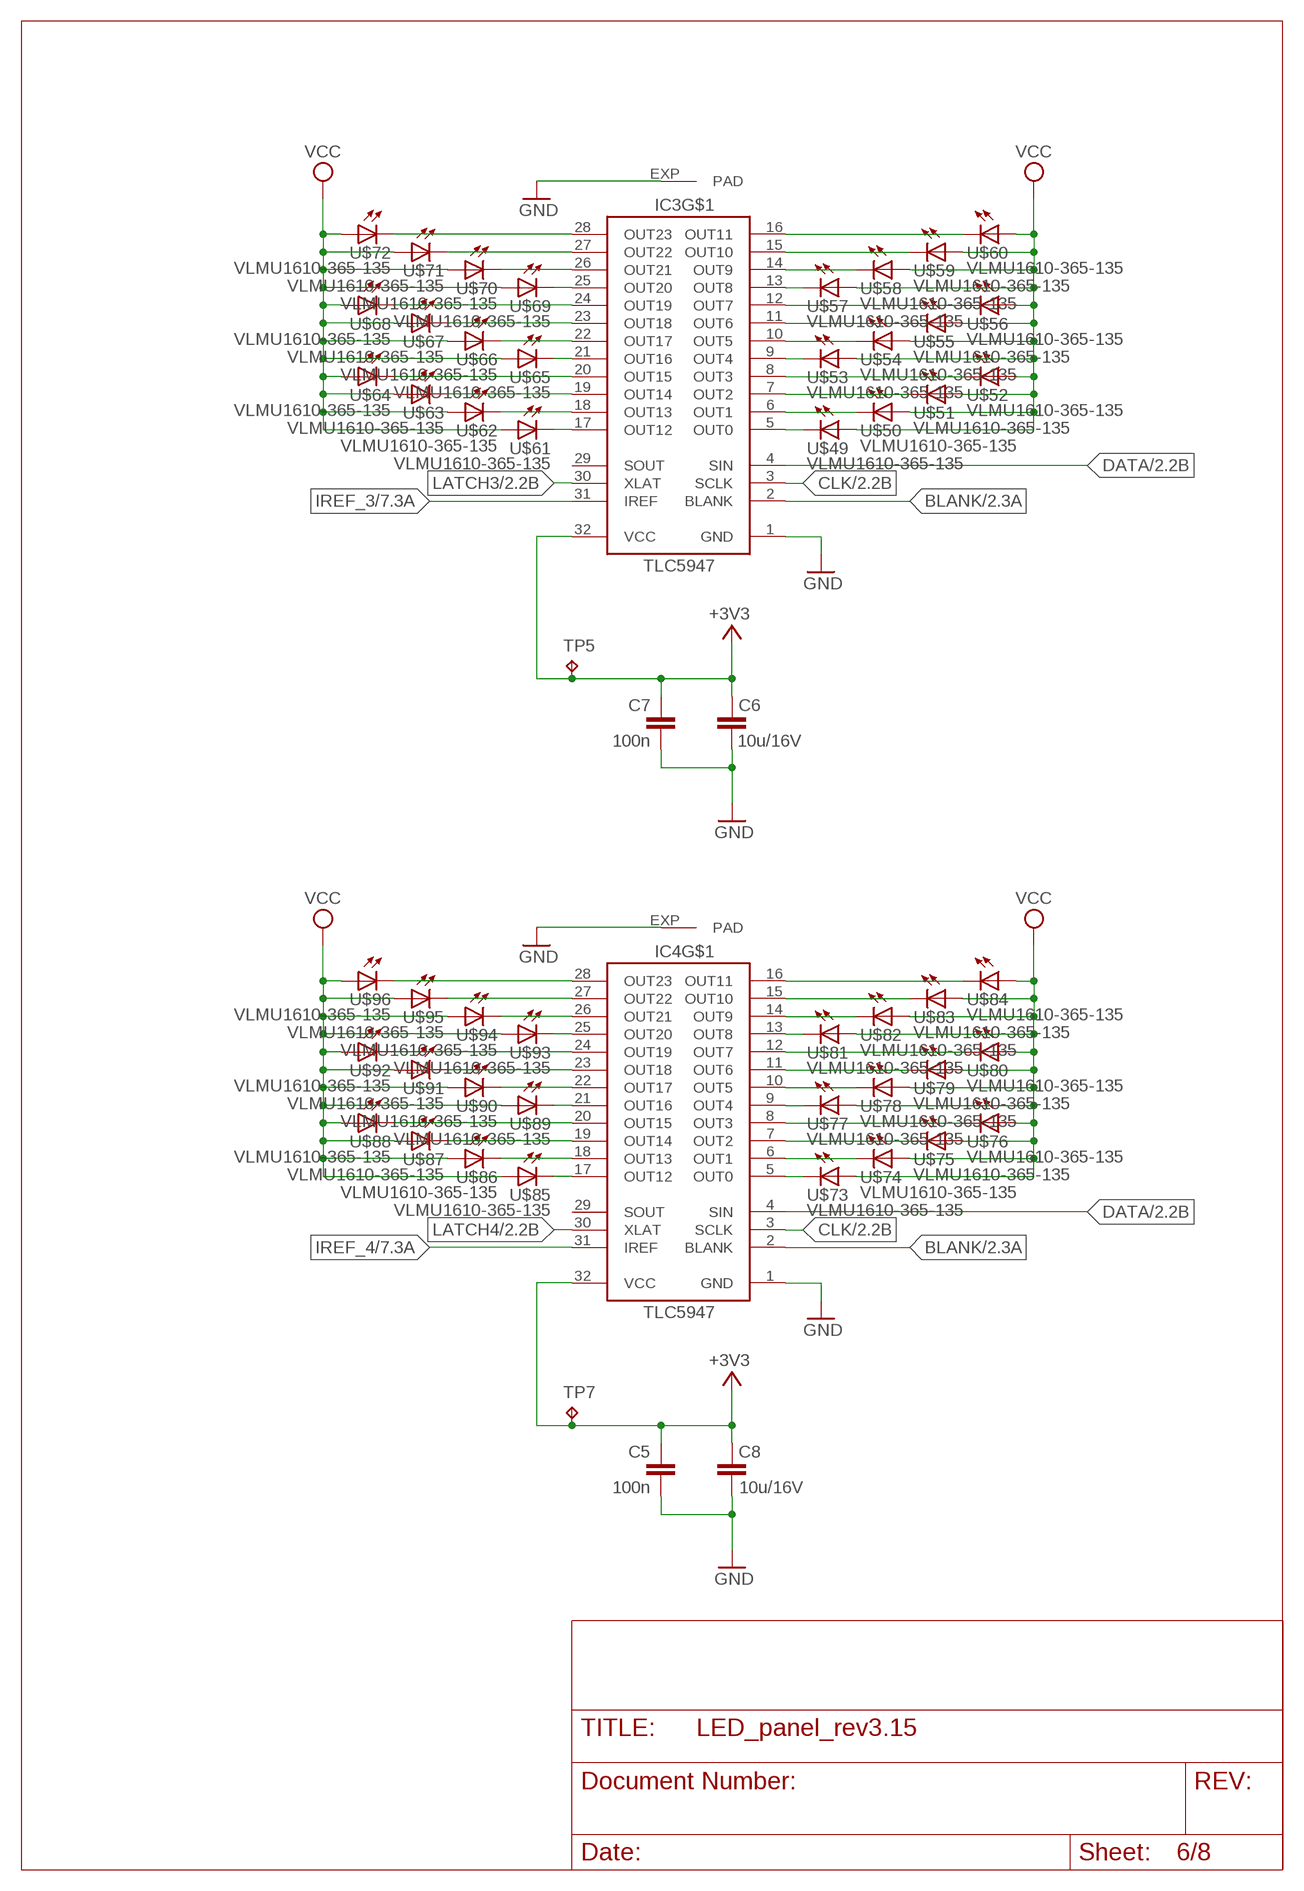
[diagram p5: schematic, sheet 6]

### Parts
C5  100n  C-EUC1206K  [C1206K]
C6  10u/16V  C-EUC1206K  [C1206K]
C7  100n  C-EUC1206K  [C1206K]
C8  10u/16V  C-EUC1206K  [C1206K]
IC3  TLC5947-DAP  [HTSSOP32DAP]
IC4  TLC5947-DAP  [HTSSOP32DAP]
TP5  TPTP20R  [TP20R]
TP7  TPTP20R  [TP20R]
U$49  VLMU1610-365-135  [SMD_CERAMIC_MID_POWER]
U$50  VLMU1610-365-135  [SMD_CERAMIC_MID_POWER]
U$51  VLMU1610-365-135  [SMD_CERAMIC_MID_POWER]
U$52  VLMU1610-365-135  [SMD_CERAMIC_MID_POWER]
U$53  VLMU1610-365-135  [SMD_CERAMIC_MID_POWER]
U$54  VLMU1610-365-135  [SMD_CERAMIC_MID_POWER]
U$55  VLMU1610-365-135  [SMD_CERAMIC_MID_POWER]
U$56  VLMU1610-365-135  [SMD_CERAMIC_MID_POWER]
U$57  VLMU1610-365-135  [SMD_CERAMIC_MID_POWER]
U$58  VLMU1610-365-135  [SMD_CERAMIC_MID_POWER]
U$59  VLMU1610-365-135  [SMD_CERAMIC_MID_POWER]
U$60  VLMU1610-365-135  [SMD_CERAMIC_MID_POWER]
U$61  VLMU1610-365-135  [SMD_CERAMIC_MID_POWER]
U$62  VLMU1610-365-135  [SMD_CERAMIC_MID_POWER]
U$63  VLMU1610-365-135  [SMD_CERAMIC_MID_POWER]
U$64  VLMU1610-365-135  [SMD_CERAMIC_MID_POWER]
U$65  VLMU1610-365-135  [SMD_CERAMIC_MID_POWER]
U$66  VLMU1610-365-135  [SMD_CERAMIC_MID_POWER]
U$67  VLMU1610-365-135  [SMD_CERAMIC_MID_POWER]
U$68  VLMU1610-365-135  [SMD_CERAMIC_MID_POWER]
U$69  VLMU1610-365-135  [SMD_CERAMIC_MID_POWER]
U$70  VLMU1610-365-135  [SMD_CERAMIC_MID_POWER]
U$71  VLMU1610-365-135  [SMD_CERAMIC_MID_POWER]
U$72  VLMU1610-365-135  [SMD_CERAMIC_MID_POWER]
U$73  VLMU1610-365-135  [SMD_CERAMIC_MID_POWER]
U$74  VLMU1610-365-135  [SMD_CERAMIC_MID_POWER]
U$75  VLMU1610-365-135  [SMD_CERAMIC_MID_POWER]
U$76  VLMU1610-365-135  [SMD_CERAMIC_MID_POWER]
U$77  VLMU1610-365-135  [SMD_CERAMIC_MID_POWER]
U$78  VLMU1610-365-135  [SMD_CERAMIC_MID_POWER]
U$79  VLMU1610-365-135  [SMD_CERAMIC_MID_POWER]
U$80  VLMU1610-365-135  [SMD_CERAMIC_MID_POWER]
U$81  VLMU1610-365-135  [SMD_CERAMIC_MID_POWER]
U$82  VLMU1610-365-135  [SMD_CERAMIC_MID_POWER]
U$83  VLMU1610-365-135  [SMD_CERAMIC_MID_POWER]
U$84  VLMU1610-365-135  [SMD_CERAMIC_MID_POWER]
U$85  VLMU1610-365-135  [SMD_CERAMIC_MID_POWER]
U$86  VLMU1610-365-135  [SMD_CERAMIC_MID_POWER]
U$87  VLMU1610-365-135  [SMD_CERAMIC_MID_POWER]
U$88  VLMU1610-365-135  [SMD_CERAMIC_MID_POWER]
U$89  VLMU1610-365-135  [SMD_CERAMIC_MID_POWER]
U$90  VLMU1610-365-135  [SMD_CERAMIC_MID_POWER]
U$91  VLMU1610-365-135  [SMD_CERAMIC_MID_POWER]
U$92  VLMU1610-365-135  [SMD_CERAMIC_MID_POWER]
U$93  VLMU1610-365-135  [SMD_CERAMIC_MID_POWER]
U$94  VLMU1610-365-135  [SMD_CERAMIC_MID_POWER]
U$95  VLMU1610-365-135  [SMD_CERAMIC_MID_POWER]
U$96  VLMU1610-365-135  [SMD_CERAMIC_MID_POWER]

### Nets
+3V3 [supply]: C5.2 C6.2 C7.2 C8.2 IC3.32(VCC) IC4.32(VCC) TP5.TP TP7.TP ; also sheet 1,2,3,4,5
BLANK: IC3.2(BLANK) IC4.2(BLANK) ; also sheet 2,5
CLK: IC3.3(SCLK) IC4.3(SCLK) ; also sheet 2,5
DATA: IC3.4(SIN) IC4.4(SIN) ; also sheet 2,5
GND [supply]: C5.1 C6.1 C7.1 C8.1 IC3.1(GND) IC3.EXP(PAD) IC4.1(GND) IC4.EXP(PAD) ; also sheet 1,2,3,4,5,7
IREF_3: IC3.31(IREF) ; also sheet 7
IREF_4: IC4.31(IREF) ; also sheet 7
LATCH3: IC3.30(XLAT) ; also sheet 2
LATCH4: IC4.30(XLAT) ; also sheet 2
N$58: IC3.28(OUT23) U$72.P$2(C)
N$59: IC3.27(OUT22) U$71.P$2(C)
N$60: IC3.26(OUT21) U$70.P$2(C)
N$61: IC3.25(OUT20) U$69.P$2(C)
N$62: IC3.24(OUT19) U$68.P$2(C)
N$63: IC3.23(OUT18) U$67.P$2(C)
N$64: IC3.22(OUT17) U$66.P$2(C)
N$65: IC3.21(OUT16) U$65.P$2(C)
N$66: IC3.20(OUT15) U$64.P$2(C)
N$67: IC3.19(OUT14) U$63.P$2(C)
N$68: IC3.18(OUT13) U$62.P$2(C)
N$69: IC3.17(OUT12) U$61.P$2(C)
N$70: IC3.16(OUT11) U$60.P$2(C)
N$71: IC3.15(OUT10) U$59.P$2(C)
N$72: IC3.14(OUT9) U$58.P$2(C)
N$73: IC3.13(OUT8) U$57.P$2(C)
N$74: IC3.12(OUT7) U$56.P$2(C)
N$75: IC3.11(OUT6) U$55.P$2(C)
N$76: IC3.10(OUT5) U$54.P$2(C)
N$77: IC3.9(OUT4) U$53.P$2(C)
N$78: IC3.8(OUT3) U$52.P$2(C)
N$79: IC3.7(OUT2) U$51.P$2(C)
N$80: IC3.6(OUT1) U$50.P$2(C)
N$81: IC3.5(OUT0) U$49.P$2(C)
N$85: IC4.28(OUT23) U$96.P$2(C)
N$86: IC4.27(OUT22) U$95.P$2(C)
N$87: IC4.26(OUT21) U$94.P$2(C)
N$88: IC4.25(OUT20) U$93.P$2(C)
N$89: IC4.24(OUT19) U$92.P$2(C)
N$90: IC4.23(OUT18) U$91.P$2(C)
N$91: IC4.22(OUT17) U$90.P$2(C)
N$92: IC4.21(OUT16) U$89.P$2(C)
N$93: IC4.20(OUT15) U$88.P$2(C)
N$94: IC4.19(OUT14) U$87.P$2(C)
N$95: IC4.18(OUT13) U$86.P$2(C)
N$96: IC4.17(OUT12) U$85.P$2(C)
N$97: IC4.16(OUT11) U$84.P$2(C)
N$98: IC4.15(OUT10) U$83.P$2(C)
N$99: IC4.14(OUT9) U$82.P$2(C)
N$100: IC4.13(OUT8) U$81.P$2(C)
N$101: IC4.12(OUT7) U$80.P$2(C)
N$102: IC4.11(OUT6) U$79.P$2(C)
N$103: IC4.10(OUT5) U$78.P$2(C)
N$104: IC4.9(OUT4) U$77.P$2(C)
N$105: IC4.8(OUT3) U$76.P$2(C)
N$106: IC4.7(OUT2) U$75.P$2(C)
N$107: IC4.6(OUT1) U$74.P$2(C)
N$108: IC4.5(OUT0) U$73.P$2(C)
VCC [supply]: U$49.P$1(A) U$50.P$1(A) U$51.P$1(A) U$52.P$1(A) U$53.P$1(A) U$54.P$1(A) U$55.P$1(A) U$56.P$1(A) U$57.P$1(A) U$58.P$1(A) U$59.P$1(A) U$60.P$1(A) U$61.P$1(A) U$62.P$1(A) U$63.P$1(A) U$64.P$1(A) U$65.P$1(A) U$66.P$1(A) U$67.P$1(A) U$68.P$1(A) U$69.P$1(A) U$70.P$1(A) U$71.P$1(A) U$72.P$1(A) U$73.P$1(A) U$74.P$1(A) U$75.P$1(A) U$76.P$1(A) U$77.P$1(A) U$78.P$1(A) U$79.P$1(A) U$80.P$1(A) U$81.P$1(A) U$82.P$1(A) U$83.P$1(A) U$84.P$1(A) U$85.P$1(A) U$86.P$1(A) U$87.P$1(A) U$88.P$1(A) U$89.P$1(A) U$90.P$1(A) U$91.P$1(A) U$92.P$1(A) U$93.P$1(A) U$94.P$1(A) U$95.P$1(A) U$96.P$1(A) ; also sheet 1,3,5
Unconnected: IC3.29(SOUT) IC4.29(SOUT)

## Sheet 7 of 8
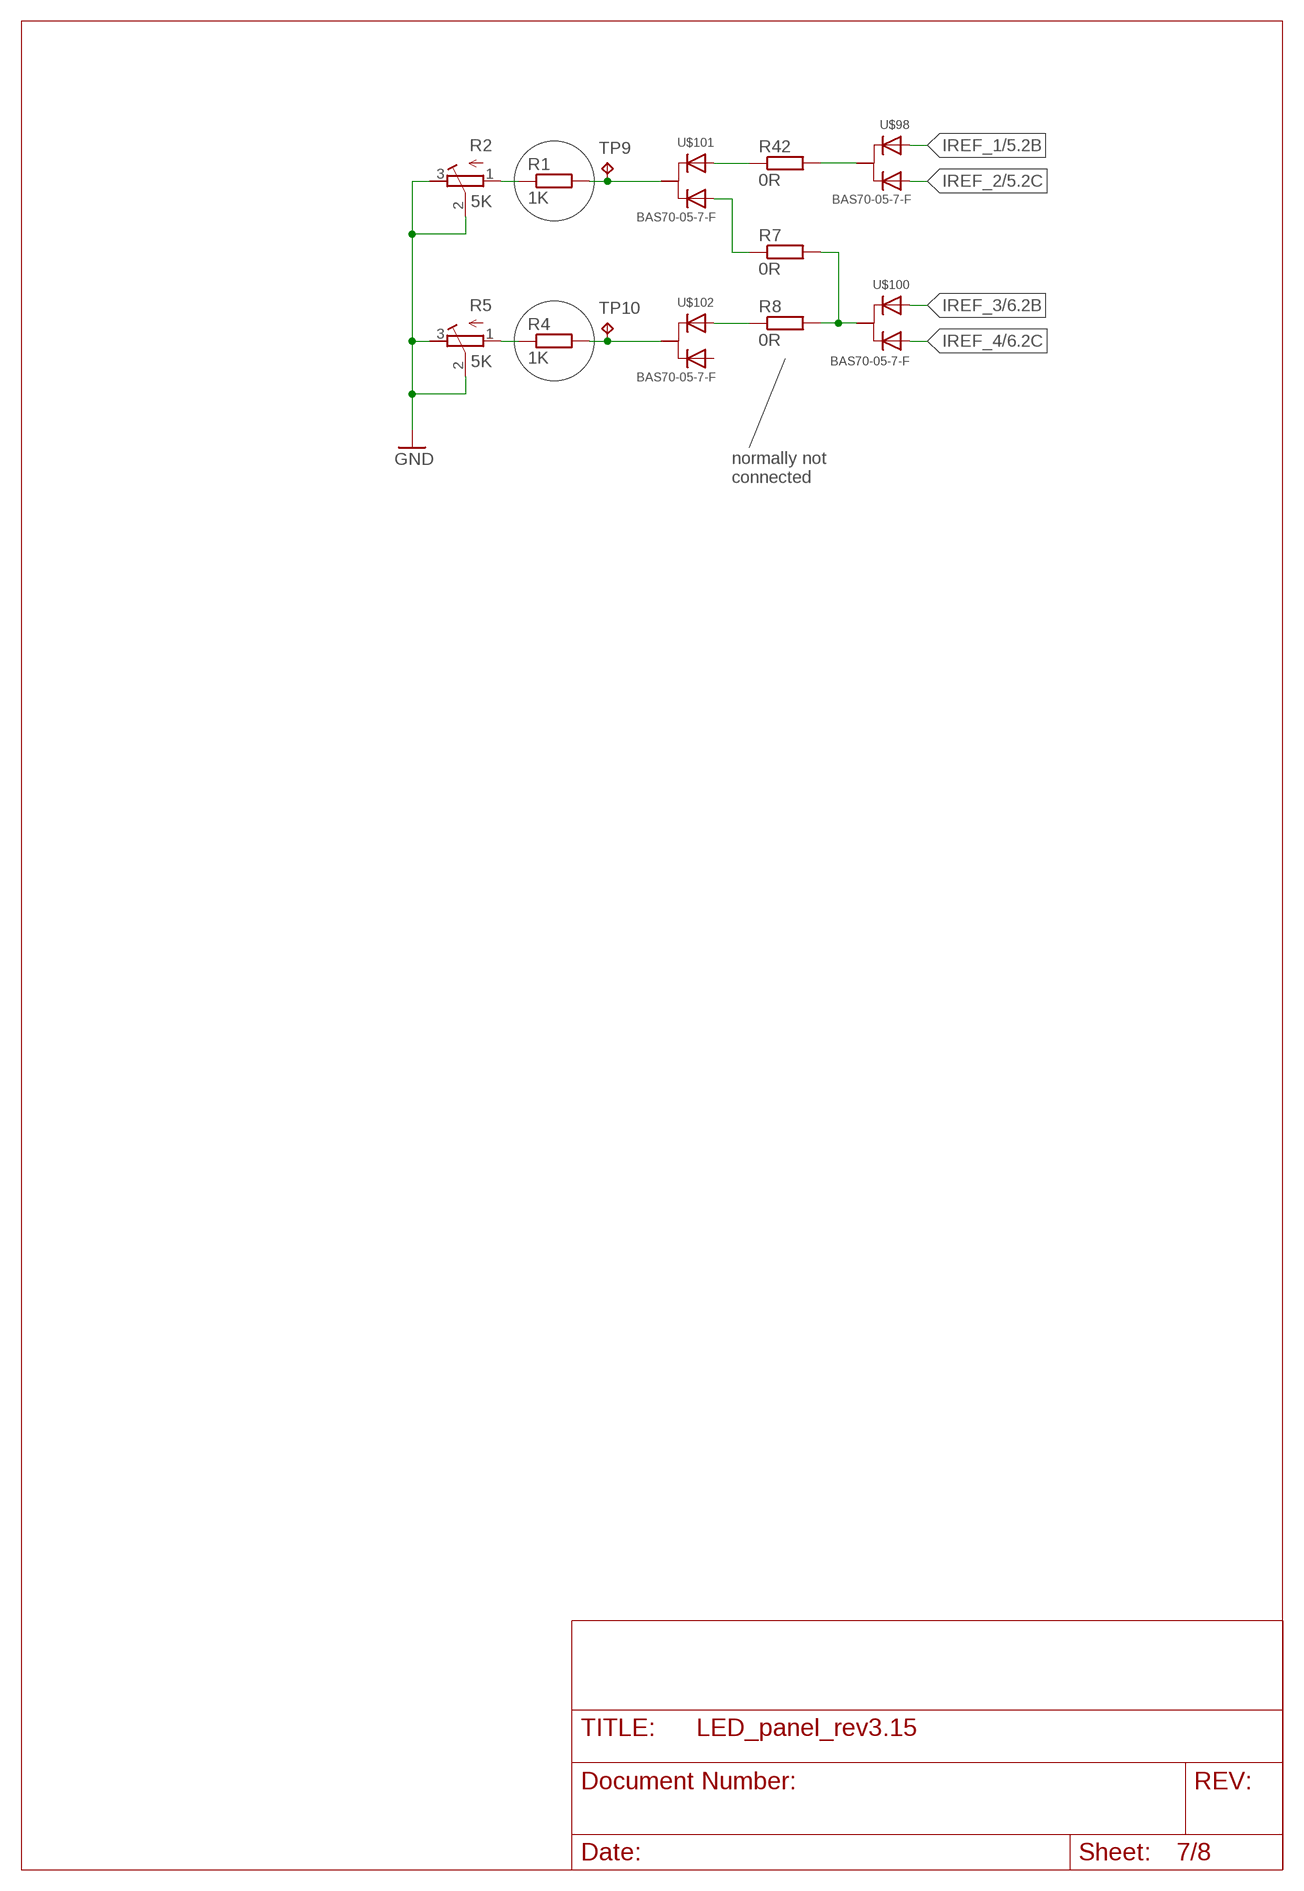
[diagram p6: schematic, sheet 7]

### Parts
R1  1K  R-EU_R1206  [R1206]
R2  5K  R-TRIMM4G/J  [RTRIM4G/J]
R4  1K  R-EU_R1206  [R1206]
R5  5K  R-TRIMM4G/J  [RTRIM4G/J]
R7  0R  R-EU_R1206  [R1206]
R8  0R  R-EU_R1206  [R1206]
R42  0R  R-EU_R1206  [R1206]
TP9  TPTP20R  [TP20R]
TP10  TPTP20R  [TP20R]
U$98  BAS70-05-7-F  [SOT23]
U$100  BAS70-05-7-F  [SOT23]
U$101  BAS70-05-7-F  [SOT23]
U$102  BAS70-05-7-F  [SOT23]

### Nets
GND [supply]: R2.2(S) R2.3(E) R5.2(S) R5.3(E) ; also sheet 1,2,3,4,5,6
IREF_1: U$98.2(B) ; also sheet 5
IREF_1&2: R42.2 U$98.3(C)
IREF_2: U$98.1(A) ; also sheet 5
IREF_3: U$100.2(B) ; also sheet 6
IREF_3&4: R7.2 R8.2 U$100.3(C)
IREF_4: U$100.1(A) ; also sheet 6
N$2: R1.1 R2.1(A)
N$3: R4.1 R5.1(A)
N$21: R1.2 TP9.TP U$101.3(C)
N$114: R4.2 TP10.TP U$102.3(C)
N$119: R42.1 U$101.2(B)
N$121: R7.1 U$101.1(A)
N$122: R8.1 U$102.2(B)
Unconnected: U$102.1(A)

### Notes on the sheet
- normally not
  connected

## Sheet 8 of 8

## Library data of the parts
C1-C32 = rcl:C-EU: CAPACITOR, European symbol; SPICEPREFIX: C
DISPLAY = mh_con_Ista:FE04-1
FE01 FE02 = mh_con_Ista:FE14-1
IC1-IC4 = adafruit:TLC5947
IC5 IC6 = mh_sensors:MCP9808: MCP9808-E/MS Temperatursensor-IC, AEC-Q100, Digital, ± 0.25°C, -40 °C, +125 °C, MSOP, 8 Pin(s) http://de.farnell.com/microchip/mcp9808-e-ms/temp-sensor-i2c-20-b-100-c-8msop/dp/2080523
J1 J3-J5 = USB3065-XX-00-A_REVE:WE_629105136821
LED1 LED3 = mh_leds:KPT-1608LVSECK-J3-PRV: KPT-1608LVSECK-J3-PRV LED, 1.6mm x 0.8mm, Rot, Oberflächenmontage, 2 mA, 1.8 V, 625 nm http://www.farnell.com/datasheets/2068420.pdf
LED2 = mh_leds:KPT-1608LVZGCK: KPT-1608LVZGCK LED, 1.6mm x 0.8mm, Grün, Oberflächenmontage, 2 mA, 2.65 V, 525 nm Source: http://www.farnell.com/datasheets/2068423.pdf
PAD1-PAD19 = wirepad:2,54/1,0: THROUGH-HOLE PAD
Q2 = transistor-pnp:BC807*: PNP Transistror
R1 R3 R4 R6-R26 R34-R42 = rcl:R-EU_: RESISTOR, European symbol; SPICEPREFIX: R
R2 R5 = rcl:R-TRIMM: Trimm resistor; SPICEMODEL: X; SPICEPREFIXL: POT
ROTARY_ENCODER = mh_con_Ista:FE05-1
SV_FAN = mh_con_Ista:FE02-1
TP1 TP3 TP5 TP7 TP9 TP10 = testpad:TP: Test pad
U1 = mh_sensors:ADXL345BCCZ: IC, ACCELEROMETER, 3AXIS; MPN: ADXL345BCCZ; OC_FARNELL: 1853935; OC_NEWARK: 04R8114; PACKAGE: 14-Terminal Land Grid Array [LGA]; SUPPLIER: Analog Devices
U$1-U$96 = iGemLEDs:VLMU1610-365-135
U$97 = mh_connectivity:BLUETOOTH-RN-41: Roving Networks RN-41 Bluetooth Module The RN-41 module is a small form factor, low power, class 1 Bluetooth radio that is ideal for designers who want to add wireless capability to their products without spending significant time and money developing Bluetooth-specific hardware and software. The RN-41 supports multiple interface protocols, is simple to design in, and is fully certified, making it a complete embedded Bluetooth solution. SparkFun Products: Bluetooth SMD Module - RN-41 <https://www.sparkfun.com/products/12575> (WRL-12575) Bluetooth Module Breakout - Roving Networks (RN-41 v6.15) <https://www.sparkfun.com/products/12579> (WRL-12579); PROD_ID: IC-11844; SF_ID: WRL-12575
U$98 U$100-U$102 = mh_diodes:BAS70-05-7-F
U$99 = mh_logo:LOGO_RESTRICT

## Net classes
1 supply: width 0.152 mm, clearance 0.229 mm to class 0, clearance 0.305 mm